# Altium project conn_board.PrjPcb (part 2 of 3)
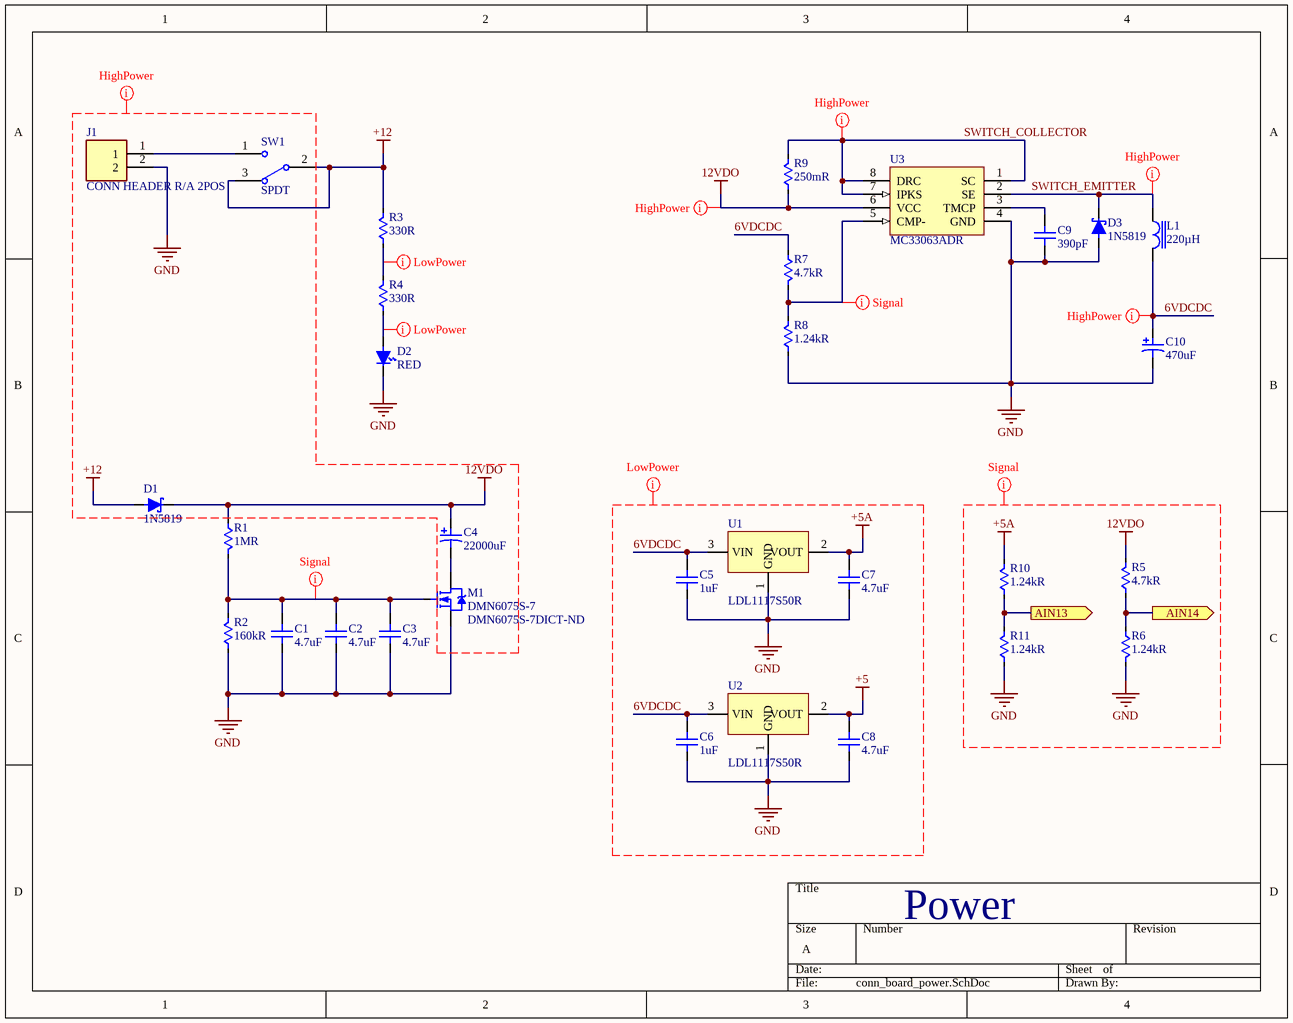
[diagram p3: conn_board_power.SchDoc]

## Sheet conn_board_power.SchDoc (continued)
### Library data of the parts
C1-C3 C7 C8 = CL21A475KAQNNNE: SAMSUNG ELECTRO-MECHANICS - CL21A475KAQNNNE - SMD Multilayer Ceramic Capacitor, 4.7 µF, 25 V, 0805 [2012 Metric], ± 10%, X5R, CL Series; Voltage Rating (DC): 25V; Supplier 1: Digi-Key; Manufacturer: Samsung; Manufacturer Part Number: CL21A475KAQNNNE; RoHS: Yes; Category: Ceramic Capacitors; Stock 1: 671990; Pricing 1: 1=0.11000, 10=0.08100, 50=0.04600, 100=0.03820, 500=0.02678, 1000=0.02216 (USD); Mount: Surface Mount; Case/Package: 0805; Case Code (Metric): 2012; Case Code (Imperial): 0805; Min Operating Temperature: -55°C; Max Operating Temperature: 85°C; Dielectric: X5R; Package Quantity: 1; Packaging: Tape and Reel; Capacitance: 4.7uF; Tolerance: 10%; Voltage Rating: 25V; Length: 2mm; Width: 0.049inch; Height: 1.25mm; Thickness: 0.055inch; Depth: 1.25mm; Radiation Hardening: No; Lead Free: Lead Free; ComponentLink1URL: https://datasheet.ciiva.com/25798/cl21a475kaqnnne-25798882.pdf?src-supplier=Digi-Key; ComponentLink1Description: https://datasheet.ciiva.com/25798/cl21a475kaqnnne-25798882.pdf?src-supplier=Digi-Key; Supplier Part Number 1: 1276-1244-1-ND
C4 = UVR1C223MRD6: Cap Aluminum 22000uF 16V 20% (25 X 40mm) Radial 12.5mm 4000mA 2000 hr 85°C Bulk; Manufacturer: Nichicon; Dielectric Material: Aluminium; Capacitance: 22mF; Ripple Current: 4A; Dissipation Factor: 0.2%; Leakage Current: 10.56mA; Life (Hours): 2000Hour; Lead Diameter: 1mm; Supplier 1: Digi-Key; Manufacturer Part Number: UVR1C223MRD6; Category: Capacitor; Stock 1: 153; Pricing 1: 1=3.85000, 10=3.46700, 50=3.00440, 100=2.61910, 500=2.15694, 1000=2.00287, 2500=1.96436, 5000=1.92584 (USD); Mount: Through Hole; Case/Package: Radial; Number of Pins: 2; Contact Plating: Tin; Min Operating Temperature: -40°C; Max Operating Temperature: 85°C; Package Quantity: 180; Packaging: Bulk; Tolerance: 20%; Voltage Rating: 16V; Termination: Radial; Voltage Rating (DC): 16V; Diameter: 25mm; Length: 40mm; Height: 40mm; Lead Pitch: 12.5mm; Height - Seated (Max): 1.575inch; Radiation Hardening: No; Lead Free: Lead Free; ComponentLink1URL: https://datasheet.ciiva.com/17515/e-vr-17515877.pdf?src-supplier=Avnet+Europe; ComponentLink1Description: https://datasheet.ciiva.com/17515/e-vr-17515877.pdf?src-supplier=Avnet+Europe; ComponentLink2URL: https://datasheet.ciiva.com/118/e-vr-118733.pdf?src-supplier=Digi-Key; ComponentLink2Description: https://datasheet.ciiva.com/118/e-vr-118733.pdf?src-supplier=Digi-Key; ComponentLink3URL: http://datasheet.octopart.com/UVR1C223MRD6-Nichicon-datasheet-2149.pdf?src-supplier=Digi-Key; ComponentLink3Description: http://datasheet.octopart.com/UVR1C223MRD6-Nichicon-datasheet-2149.pdf?src-supplier=Digi-Key; ComponentLink4URL: http://datasheet.octopart.com/UVR1C223MRD6-Nichicon-datasheet-12518647.pdf?src-supplier=Newark; ComponentLink4Description: http://datasheet.octopart.com/UVR1C223MRD6-Nichicon-datasheet-12518647.pdf?src-supplier=Newark; ComponentLink5URL: http://datasheet.octopart.com/UVR1C223MRD6-Nichicon-datasheet-24896455.pdf?src-supplier=TME; ComponentLink5Description: http://datasheet.octopart.com/UVR1C223MRD6-Nichicon-datasheet-24896455.pdf?src-supplier=TME; ComponentLink6URL: http://datasheet.octopart.com/UVR1C223MRD6-Nichicon-datasheet-41169141.pdf?src-supplier=Newark; ComponentLink6Description: http://datasheet.octopart.com/UVR1C223MRD6-Nichicon-datasheet-41169141.pdf?src-supplier=Newark; ComponentLink7URL: http://datasheet.octopart.com/UVR1C223MRD6-Nichicon-datasheet-58177256.pdf?src-supplier=Newark; ComponentLink7Description: http://datasheet.octopart.com/UVR1C223MRD6-Nichicon-datasheet-58177256.pdf?src-supplier=Newark; Supplier Part Number 1: 493-1054-ND
C5 C6 = C0805C105Z4VACTU: Cap Ceramic 1uF 16V Y5V -20% to 80% Pad SMD 0805 85C T/R; Manufacturer: KEMET; Dissipation Factor: 7%; Supplier 1: Digi-Key; Manufacturer Part Number: C0805C105Z4VACTU; Category: Capacitor; Stock 1: 83211; Pricing 1: 1=0.11000, 10=0.08100, 50=0.04420, 100=0.03620, 500=0.02584, 1000=0.02030 (USD); Mount: Surface Mount; Case/Package: 0805; Number of Pins: 2; Case Code (Metric): 2012; Case Code (Imperial): 0805; Contact Material: Tin; Dielectric Material: Ceramic; Min Operating Temperature: -30°C; Max Operating Temperature: 85°C; Package Quantity: 1; Capacitance: 1uF; Voltage Rating: 16V; Tolerance: 80%; Packaging: Tape and Reel; Voltage Rating (DC): 16V; Dielectric: Y5V; Termination: SMD/SMT; Voltage: 16V; Length: 2mm; Height: 1.25mm; Width: 0.049inch; Thickness: 0.055inch; Lead Pitch: 0.75mm; Depth: 1.25mm; Radiation Hardening: No; REACH SVHC: No SVHC; Lead Free: Lead Free; ComponentLink1URL: https://datasheet.ciiva.com/6074/1698780-6074369.pdf?src-supplier=Farnell; ComponentLink1Description: https://datasheet.ciiva.com/6074/1698780-6074369.pdf?src-supplier=Farnell; ComponentLink2URL: https://datasheet.ciiva.com/16623/datasheetpn-c0805c105z4vac7800-16623623.pdf?src-supplier=Avnet+Europe; ComponentLink2Description: https://datasheet.ciiva.com/16623/datasheetpn-c0805c105z4vac7800-16623623.pdf?src-supplier=Avnet+Europe; ComponentLink3URL: https://datasheet.ciiva.com/14604/70095383-14604106.pdf?src-supplier=Allied+Electronics; ComponentLink3Description: https://datasheet.ciiva.com/14604/70095383-14604106.pdf?src-supplier=Allied+Electronics; ComponentLink4URL: https://datasheet.ciiva.com/7600/1698780-7600029.pdf?src-supplier=Newark; ComponentLink4Description: https://datasheet.ciiva.com/7600/1698780-7600029.pdf?src-supplier=Newark; ComponentLink5URL: https://datasheet.ciiva.com/14589/70095383-14589407.pdf?src-supplier=Allied+Electronics; ComponentLink5Description: https://datasheet.ciiva.com/14589/70095383-14589407.pdf?src-supplier=Allied+Electronics; ComponentLink6URL: http://datasheet.octopart.com/C0805C105Z4VACTU-Kemet-datasheet-13692877.pdf?src-supplier=Element14; ComponentLink6Description: http://datasheet.octopart.com/C0805C105Z4VACTU-Kemet-datasheet-13692877.pdf?src-supplier=Element14; ComponentLink7URL: http://datasheet.octopart.com/C0805C105Z4VACTU-Kemet-datasheet-503297.pdf?src-supplier=Newark; ComponentLink7Description: http://datasheet.octopart.com/C0805C105Z4VACTU-Kemet-datasheet-503297.pdf?src-supplier=Newark; ComponentLink8URL: http://datasheet.octopart.com/C0805C105Z4VACTU-KEMET-datasheet-101576167.pdf?src-supplier=Farnell; ComponentLink8Description: http://datasheet.octopart.com/C0805C105Z4VACTU-KEMET-datasheet-101576167.pdf?src-supplier=Farnell; ComponentLink9URL: http://datasheet.octopart.com/C0805C105Z4VACTU-KEMET-datasheet-83957834.pdf?src-supplier=TME; ComponentLink9Description: http://datasheet.octopart.com/C0805C105Z4VACTU-KEMET-datasheet-83957834.pdf?src-supplier=TME; ComponentLink10URL: http://datasheet.octopart.com/C0805C105Z4VACTU-Kemet-datasheet-5313890.pdf?src-supplier=Verical; ComponentLink10Description: http://datasheet.octopart.com/C0805C105Z4VACTU-Kemet-datasheet-5313890.pdf?src-supplier=Verical; ComponentLink11URL: http://datasheet.octopart.com/C0805C105Z4VAC-TU-Kemet-datasheet-8204015.pdf?src-supplier=Jameco; ComponentLink11Description: http://datasheet.octopart.com/C0805C105Z4VAC-TU-Kemet-datasheet-8204015.pdf?src-supplier=Jameco; ComponentLink12URL: http://datasheet.octopart.com/C0805C105Z4VACTU-Kemet-datasheet-464.pdf?src-supplier=Allied+Electronics; ComponentLink12Description: http://datasheet.octopart.com/C0805C105Z4VACTU-Kemet-datasheet-464.pdf?src-supplier=Allied+Electronics; ComponentLink13URL: http://datasheet.octopart.com/C0805C105Z4VACTU-Kemet-datasheet-11554470.pdf?src-supplier=Arrow; ComponentLink13Description: http://datasheet.octopart.com/C0805C105Z4VACTU-Kemet-datasheet-11554470.pdf?src-supplier=Arrow; ComponentLink14URL: http://datasheet.octopart.com/C0805C105Z4VACTU-Kemet-datasheet-66128697.pdf?src-supplier=Element14; ComponentLink14Description: http://datasheet.octopart.com/C0805C105Z4VACTU-Kemet-datasheet-66128697.pdf?src-supplier=Element14; ComponentLink15URL: http://datasheet.octopart.com/C0805C105Z4VACTU-Kemet-datasheet-66325528.pdf?src-supplier=Newark; ComponentLink15Description: http://datasheet.octopart.com/C0805C105Z4VACTU-Kemet-datasheet-66325528.pdf?src-supplier=Newark; ComponentLink16URL: http://datasheet.octopart.com/C0805C105Z4VACTU-Kemet-datasheet-67847115.pdf?src-supplier=TME; ComponentLink16Description: http://datasheet.octopart.com/C0805C105Z4VACTU-Kemet-datasheet-67847115.pdf?src-supplier=TME; ComponentLink17URL: http://datasheet.octopart.com/C0805C105Z4VACTU-KEMET-datasheet-84169754.pdf; ComponentLink17Description: http://datasheet.octopart.com/C0805C105Z4VACTU-KEMET-datasheet-84169754.pdf; ComponentLink18URL: http://datasheet.octopart.com/C0805C105Z4VACTU-KEMET-datasheet-41193421.pdf?src-supplier=Master+Electronics; ComponentLink18Description: http://datasheet.octopart.com/C0805C105Z4VACTU-KEMET-datasheet-41193421.pdf?src-supplier=Master+Electronics; Supplier Part Number 1: 399-8011-1-ND
C9 = CL21C391JBANNNC: Cap Ceramic 390pF 50V C0G 5% SMD 0805 125C Paper T/R; Manufacturer: Samsung; Temperature Coefficient: 300ppm/°C; Supplier 1: Digi-Key; Manufacturer Part Number: CL21C391JBANNNC; RoHS: Yes; Category: Ceramic Capacitors; Stock 1: 98292; Pricing 1: 1=0.11000, 10=0.08400, 50=0.04580, 100=0.03740, 500=0.02668, 1000=0.02096 (USD); Mount: Surface Mount; Case/Package: 0805; Case Code (Metric): 2012; Case Code (Imperial): 0805; Material: Ceramic; Min Operating Temperature: -55°C; Max Operating Temperature: 125°C; Tolerance: 5%; Capacitance: 390pF; Dielectric: C0G; Package Quantity: 1; Packaging: Tape and Reel; Voltage Rating: 50V; Voltage: 50V; Series: CL; Construction: Flat; Length: 2mm; Width: 0.049inch; Height: 0.65mm; Depth: 1.25mm; Thickness: 0.03inch; Radiation Hardening: No; RoHS Compliant: Yes; ComponentLink1URL: https://datasheet.ciiva.com/25733/cl21c391jbannnc-25733106.pdf?src-supplier=Digi-Key; ComponentLink1Description: https://datasheet.ciiva.com/25733/cl21c391jbannnc-25733106.pdf?src-supplier=Digi-Key; ComponentLink2URL: https://datasheet.ciiva.com/26838/getdatasheetpartid-687114-26838793.pdf?src-supplier=Verical; ComponentLink2Description: https://datasheet.ciiva.com/26838/getdatasheetpartid-687114-26838793.pdf?src-supplier=Verical; ComponentLink3URL: https://datasheet.ciiva.com/29200/453712-da-01-en-vs-kondensator-0805-29200047.pdf?src-supplier=Conrad; ComponentLink3Description: https://datasheet.ciiva.com/29200/453712-da-01-en-vs-kondensator-0805-29200047.pdf?src-supplier=Conrad; ComponentLink4URL: https://datasheet.ciiva.com/16448/cl05b104kq5nnnc-16448985.pdf?src-supplier=Future+Electronics; ComponentLink4Description: https://datasheet.ciiva.com/16448/cl05b104kq5nnnc-16448985.pdf?src-supplier=Future+Electronics; Supplier Part Number 1: 1276-1303-1-ND
C10 = UUD1C471MNL1GS: NICHICON   UUD1C471MNL1GS   CAP, ALU ELEC, 470UF, 16V, SMD; Dielectric Material: Aluminium; Tolerance: 20%; Leakage Current: 3uA; Ripple Current: 450mA; Life (Hours): 5000Hour; Dissipation Factor: 0.2%; Impedance: 170mR; Lead Diameter: 1.1mm; Supplier 1: Digi-Key; Manufacturer: Nichicon; Manufacturer Part Number: UUD1C471MNL1GS; RoHS: Yes; Category: Capacitor; Stock 1: 11602; Pricing 1: 1=0.69000, 10=0.50800, 25=0.43560, 100=0.34850, 250=0.31948 (USD); Case/Package: Radial; Number of Pins: 2; Contact Plating: Tin; Min Operating Temperature: -55°C; Max Operating Temperature: 105°C; Voltage Rating (DC): 16V; Capacitance: 470uF; Packaging: Tape and Reel; Package Quantity: 500; Voltage Rating: 16V; Termination: SMD/SMT; Voltage: 16V; Ripple Current (AC): 450mA; Diameter: 8mm; Length: 10mm; Height: 10mm; Height - Seated (Max): 0.394inch; Lead Pitch: 3.1mm; Radiation Hardening: No; REACH SVHC: No SVHC; Lead Free: Lead Free; ComponentLink1URL: https://datasheet.ciiva.com/11781/0900766b80fa39e7-11781894.pdf?src-supplier=RSComponents; ComponentLink1Description: https://datasheet.ciiva.com/11781/0900766b80fa39e7-11781894.pdf?src-supplier=RSComponents; ComponentLink2URL: https://datasheet.ciiva.com/97/e-ud-97896.pdf?src-supplier=Digi-Key; ComponentLink2Description: https://datasheet.ciiva.com/97/e-ud-97896.pdf?src-supplier=Digi-Key; ComponentLink3URL: https://datasheet.ciiva.com/7781/66055-7781448.pdf?src-supplier=Element14; ComponentLink3Description: https://datasheet.ciiva.com/7781/66055-7781448.pdf?src-supplier=Element14; ComponentLink4URL: https://datasheet.ciiva.com/97/e-ud-97897.pdf?src-supplier=Digi-Key; ComponentLink4Description: https://datasheet.ciiva.com/97/e-ud-97897.pdf?src-supplier=Digi-Key; ComponentLink5URL: https://datasheet.ciiva.com/22693/66055-22693551.pdf?src-supplier=Element14; ComponentLink5Description: https://datasheet.ciiva.com/22693/66055-22693551.pdf?src-supplier=Element14; ComponentLink6URL: https://datasheet.ciiva.com/97/e-ud-97898.pdf?src-supplier=Digi-Key; ComponentLink6Description: https://datasheet.ciiva.com/97/e-ud-97898.pdf?src-supplier=Digi-Key; ComponentLink7URL: https://datasheet.ciiva.com/11685/e-ud-11685293.pdf?src-supplier=Avnet; ComponentLink7Description: https://datasheet.ciiva.com/11685/e-ud-11685293.pdf?src-supplier=Avnet; ComponentLink8URL: https://datasheet.ciiva.com/16502/e-ud-16502751.pdf?src-supplier=Future+Electronics; ComponentLink8Description: https://datasheet.ciiva.com/16502/e-ud-16502751.pdf?src-supplier=Future+Electronics; Supplier Part Number 1: 493-2266-1-ND
D1 D3 = 1N5819HW-7-F: DIODES INC. - 1N5819HW-7-F - DIODE, SCKY RECTI, 1A, 40V, SOD123; Element Configuration: Single; Peak Non-Repetitive Surge Current: 25A; Forward Voltage: 450mV; Peak Reverse Current: 50uA; Polarity: Standard; Capacitance: 110pF; Max Power Dissipation: 450mW; Supplier 1: Digi-Key; Manufacturer: Diodes; Manufacturer Part Number: 1N5819HW-7-F; RoHS: Yes; Category: Diode; Stock 1: 502732; Pricing 1: 1=0.40000, 10=0.30100, 25=0.26360, 100=0.14310, 500=0.11678, 1000=0.08664 (USD); Case/Package: SOD-123-2; Number of Pins: 2; Weight: 0.000353oz; Contact Plating: Tin,Matte; Min Operating Temperature: -65°C; Max Operating Temperature: 125°C; Packaging: Tape and Reel; Package Quantity: 3000; Forward Current: 1A; Max Repetitive Reverse Voltage (Vrrm): 40V; Average Rectified Current: 1A; Max Reverse Voltage (DC): 40V; Max Forward Surge Current (Ifsm): 25A; Current Rating: 1A; Voltage Rating (DC): 40V; Output Current: 1A; Termination: SMD/SMT; Length: 2.85mm; Height: 1.25mm; Width: 1.7mm; Radiation Hardening: No; Lead Free: Lead Free; REACH SVHC: No SVHC; ComponentLink1URL: https://datasheet.ciiva.com/16303/ds30217-16303296.pdf?src-supplier=Future+Electronics; ComponentLink1Description: https://datasheet.ciiva.com/16303/ds30217-16303296.pdf?src-supplier=Future+Electronics; ComponentLink2URL: https://datasheet.ciiva.com/27092/1538419-27092484.pdf?src-supplier=Jameco; ComponentLink2Description: https://datasheet.ciiva.com/27092/1538419-27092484.pdf?src-supplier=Jameco; ComponentLink3URL: https://datasheet.ciiva.com/912/ds30217-912801.pdf?src-supplier=Digi-Key; ComponentLink3Description: https://datasheet.ciiva.com/912/ds30217-912801.pdf?src-supplier=Digi-Key; ComponentLink4URL: https://datasheet.ciiva.com/1177/ds30217-1177089.pdf?src-supplier=Element14; ComponentLink4Description: https://datasheet.ciiva.com/1177/ds30217-1177089.pdf?src-supplier=Element14; ComponentLink5URL: https://datasheet.ciiva.com/912/ds30217-912802.pdf?src-supplier=Digi-Key; ComponentLink5Description: https://datasheet.ciiva.com/912/ds30217-912802.pdf?src-supplier=Digi-Key; ComponentLink6URL: https://datasheet.ciiva.com/912/ds30217-912803.pdf?src-supplier=Digi-Key; ComponentLink6Description: https://datasheet.ciiva.com/912/ds30217-912803.pdf?src-supplier=Digi-Key; ComponentLink7URL: https://datasheet.ciiva.com/8303/ds30217-8303132.pdf?src-supplier=Avnet; ComponentLink7Description: https://datasheet.ciiva.com/8303/ds30217-8303132.pdf?src-supplier=Avnet; ComponentLink8URL: https://datasheet.ciiva.com/25919/ds30217-25919644.pdf?src-supplier=Avnet+Europe; ComponentLink8Description: https://datasheet.ciiva.com/25919/ds30217-25919644.pdf?src-supplier=Avnet+Europe; Supplier Part Number 1: 1N5819HW-FDICT-ND
D2 = 150080SS75000: WURTH ELEKTRONIK   150080SS75000   LED, 0805, SUP RED, 60MCD, 630NM; Manufacturer: Wurth Electronics; Forward Current: 30mA; Forward Voltage: 1.9V; Viewing Angle: 140°; Lens Style: Clear,Rectangular; Test Current: 20mA; Supplier 1: Digi-Key; Manufacturer Part Number: 150080SS75000; RoHS: Yes; Category: LEDs; Stock 1: 6006; Pricing 1: 1=0.18000, 50=0.16500, 100=0.14200, 500=0.12300 (USD); Mount: Surface Mount; Case/Package: 0805; Color: Red; Case Code (Metric): 2012; Case Code (Imperial): 0805; Min Operating Temperature: -40°C; Max Operating Temperature: 85°C; Luminous Intensity: 60mcd; Wavelength: 630nm; Package Quantity: 4000; Packaging: Tape and Reel; Dominant Wavelength: 630nm; Length: 2mm; Height: 0.7mm; Width: 1.25mm; REACH SVHC: Unknown; ComponentLink1URL: https://datasheet.ciiva.com/22656/150080ss75000-22656963.pdf?src-supplier=Element14; ComponentLink1Description: https://datasheet.ciiva.com/22656/150080ss75000-22656963.pdf?src-supplier=Element14; ComponentLink2URL: https://datasheet.ciiva.com/29279/759436-da-01-en-chipled-0805-w-kl-s-rot-150080ss75000-29279211.pdf?src-supplier=Conrad; ComponentLink2Description: https://datasheet.ciiva.com/29279/759436-da-01-en-chipled-0805-w-kl-s-rot-150080ss75000-29279211.pdf?src-supplier=Conrad; ComponentLink3URL: https://datasheet.ciiva.com/29563/150080ss75000-29563014.pdf?src-supplier=Digi-Key; ComponentLink3Description: https://datasheet.ciiva.com/29563/150080ss75000-29563014.pdf?src-supplier=Digi-Key; ComponentLink4URL: https://datasheet.ciiva.com/29563/150080ss75000-29563015.pdf?src-supplier=Digi-Key; ComponentLink4Description: https://datasheet.ciiva.com/29563/150080ss75000-29563015.pdf?src-supplier=Digi-Key; ComponentLink5URL: https://datasheet.ciiva.com/29563/150080ss75000-29563013.pdf?src-supplier=Digi-Key; ComponentLink5Description: https://datasheet.ciiva.com/29563/150080ss75000-29563013.pdf?src-supplier=Digi-Key; Supplier Part Number 1: 732-4985-1-ND
J1 = 1724480002: Manufacturer: Molex; Connector Type: Male Pin; Number of Circuits: 2; Row Spacing: 0.165inch; Glow Wire Compliant: Compliant; Supplier 1: Digi-Key; Manufacturer Part Number: 1724480002; RoHS: No; Category: Headers and Wire Housings; Stock 1: 6210; Pricing 1: 1=0.55000, 10=0.46000, 100=0.35780, 1000=0.28116, 5000=0.24708, 10000=0.23004 (USD); Mount: Through Hole; Number of Pins: 2; Contact Plating: Tin; Color: Black; Orientation: Right Angle; Packaging: Tray; Number of Positions: 2; Number of Rows: 2; Termination: Solder; Fastening Type: Ramp; ComponentLink1URL: https://www.molex.com/pdm_docs/sd/1724480002_sd.pdf?src-supplier=Digi-Key; ComponentLink1Description: https://www.molex.com/pdm_docs/sd/1724480002_sd.pdf?src-supplier=Digi-Key; Supplier Part Number 1: WM16206-ND
L1 = SRR1260-221K: BOURNS   SRR1260-221K   INDUCTOR, SHIELDED, 220UH, 1.3A, SMD; MF: Bourns - J.W. Miller; Core Material: Ferrite; Material: Steel; Tolerance: 10%; Max DC Current: 1.38A; DC Resistance (DCR): 380mR; Test Frequency: 100kHz; Self Resonant Frequency: 4.2MHz; Q Factor: 22; Value: *; Package: Nonstandard Bourns - J.W. Miller; Availability: Unavailable; SnapEDA_Link: https://www.snapeda.com/parts/SRR1260-221K/Bourns%20-%20J.W.%20Miller/view-part/50181/?ref=snap; MP: SRR1260-221K; Price: None; Category: Inductor; Supplier 1: Digi-Key; Manufacturer: Bourns; Manufacturer Part Number: SRR1260-221K; RoHS: Yes; Stock 1: 17151; Pricing 1: 1=1.09000, 10=1.00800, 25=0.93000, 50=0.77500, 100=0.72850, 250=0.65100 (USD); Mount: Surface Mount; Case/Package: 1260; Number of Pins: 2; Min Operating Temperature: -40°C; Max Operating Temperature: 125°C; Packaging: Tape and Reel; Termination: SMD/SMT; Resistor Type: Wirewound; Package Quantity: 600; Inductance: 220uH; Resistance: 380MR; DC Current: 1.38A; Shielding: Shielded; Current Rating: 1.38A; Saturation Current: 1.3A; RMS Current (Irms): 1.38A; Inductance Tolerance: 10%; Frequency: 4.2MHz; Length: 12.5mm; Width: 12.5mm; Height: 6mm; Depth: 12.8mm; Height - Seated (Max): 0.256inch; Military Standard: Not; REACH SVHC: No SVHC; ComponentLink1URL: https://datasheet.ciiva.com/11800/0900766b80defded-11800204.pdf?src-supplier=RSComponents; ComponentLink1Description: https://datasheet.ciiva.com/11800/0900766b80defded-11800204.pdf?src-supplier=RSComponents; ComponentLink2URL: https://datasheet.ciiva.com/7838/1430852-7838981.pdf?src-supplier=Element14; ComponentLink2Description: https://datasheet.ciiva.com/7838/1430852-7838981.pdf?src-supplier=Element14; ComponentLink3URL: https://datasheet.ciiva.com/1050/srr1260-1050007.pdf?src-supplier=Digi-Key; ComponentLink3Description: https://datasheet.ciiva.com/1050/srr1260-1050007.pdf?src-supplier=Digi-Key; ComponentLink4URL: https://datasheet.ciiva.com/17111/70277056-17111848.pdf?src-supplier=Allied+Electronics; ComponentLink4Description: https://datasheet.ciiva.com/17111/70277056-17111848.pdf?src-supplier=Allied+Electronics; ComponentLink5URL: https://datasheet.ciiva.com/23793/1914016-23793576.pdf?src-supplier=Newark; ComponentLink5Description: https://datasheet.ciiva.com/23793/1914016-23793576.pdf?src-supplier=Newark; ComponentLink6URL: https://datasheet.ciiva.com/17285/srr1260-17285833.pdf?src-supplier=Avnet+Europe; ComponentLink6Description: https://datasheet.ciiva.com/17285/srr1260-17285833.pdf?src-supplier=Avnet+Europe; ComponentLink7URL: https://datasheet.ciiva.com/8517/srr1260-8517134.pdf?src-supplier=Avnet; ComponentLink7Description: https://datasheet.ciiva.com/8517/srr1260-8517134.pdf?src-supplier=Avnet; ComponentLink8URL: https://datasheet.ciiva.com/22618/70796-22618159.pdf?src-supplier=Element14; ComponentLink8Description: https://datasheet.ciiva.com/22618/70796-22618159.pdf?src-supplier=Element14; ComponentLink9URL: https://datasheet.ciiva.com/28679/1430852-28679711.pdf?src-supplier=Element14; ComponentLink9Description: https://datasheet.ciiva.com/28679/1430852-28679711.pdf?src-supplier=Element14; ComponentLink10URL: https://datasheet.ciiva.com/1050/srr1260-1050006.pdf?src-supplier=Digi-Key; ComponentLink10Description: https://datasheet.ciiva.com/1050/srr1260-1050006.pdf?src-supplier=Digi-Key; ComponentLink11URL: https://datasheet.ciiva.com/1050/srr1260-1050008.pdf?src-supplier=Digi-Key; ComponentLink11Description: https://datasheet.ciiva.com/1050/srr1260-1050008.pdf?src-supplier=Digi-Key; Supplier Part Number 1: SRR1260-221KCT-ND
M1 = CMP-12801-000014-1: MOSFET 60V N-Ch Enh FET 20Vgss 0.8W 600pF; Manufacturer: Diodes Inc.; Max Junction Temp: +150°C; Continuous Drain Current: 2A; Rthja Max: 157°C/W; Turn On Delay Time: 3.5ns; Gate To Source Voltage: 20V; Input Capacitace At Vds: 606pF @ 20V; Depletion Mode: False; Number Of Channels: 1; Pulse Drain Current: 12A; Standoff Height: 0.013mm; Turn Off Delay Time: 35ns; Threshold Vgs Max: 3V; Automotive Grade: Grade 0; Max Forward Diode Voltage: 1.2V; Gate Charge At Vgs: 12.3nC @ 10V; Threshold Vgs Min: 1V; Drain To Source Resistance: 69mΩ; Rds On Max: 85mR; Input Capacitance: 606pF; Max Power Dissipation: 800mW; Device Class L2: Transistors; Height: 1.1mm; ComponentLink2Description: Datasheet; Footprint Url: https://www.diodes.com/assets/Package-Files/SOT23.pdf; Device Class L1: Discrete Semiconductors; Digikey Description: MOSFET N-CH 60V 2A SOT23-3; Device Class L3: MOSFETs; Mouser Description: MOSFET 60V N-Ch Enh FET 20Vgss 0.8W 600pF; Manufacturer Part Number: DMN6075S-7; Package: SOT23; Power Dissipation: 0.8W; Temperature Range High: +150°C; Drain To Source Breakdown Voltage: 60V; Automotive: Yes; Lead Free: Yes; ComponentLink2URL: https://www.diodes.com/assets/Datasheets/DMN6075S.pdf; Category: Trans; Temperature Range Low: -55°C; Number Of N Channels: 1; Octopart: https://octopart.com/dmn6075s-7-diodes+inc.-55697882; RoHS: TRUE; Temperature: -55°C to +150°C; Drain To Source Voltage: 60V; Supplier 1: Digi-Key; Stock 1: 363651; Pricing 1: 1=0.33000, 10=0.23000, 25=0.21440, 100=0.11630, 500=0.09486, 1000=0.07038 (USD); Mount: Surface Mount; Case/Package: TO-236-3; Min Operating Temperature: -55°C; Max Operating Temperature: 150°C; Packaging: Tape and Reel; Drain to Source Voltage (Vdss): 60V; Continuous Drain Current (ID): 2A; ComponentLink1URL: http://www.mouser.com/ds/2/115/DMN6075S-532804.pdf?src-supplier=Mouser; ComponentLink1Description: http://www.mouser.com/ds/2/115/DMN6075S-532804.pdf?src-supplier=Mouser; ComponentLink3URL: https://www.diodes.com/assets/Datasheets/DMN6075S.pdf?src-supplier=Digi-Key; ComponentLink3Description: https://www.diodes.com/assets/Datasheets/DMN6075S.pdf?src-supplier=Digi-Key
R1 = ERJ-6ENF1004V: Res Thick Film 0805 1M Ohm 1% 1/8W ±100ppm/°C Molded SMD Punched Carrier T/R; Manufacturer: Panasonic; Power Rating: 125mW; Voltage Rating: 150V; Supplier 1: Digi-Key; Manufacturer Part Number: ERJ-6ENF1004V; Category: Resistor; Stock 1: 249385; Pricing 1: 1=0.10000, 10=0.06900, 100=0.02650, 1000=0.01166, 2500=0.01007 (USD); Mount: Surface Mount; Case/Package: 0805; Number of Pins: 2; Case Code (Imperial): 0805; Case Code (Metric): 2012; Contact Plating: Tin; Min Operating Temperature: -55°C; Max Operating Temperature: 155°C; Package Quantity: 1; Resistance: 1MR; Packaging: Tape and Reel; Tolerance: 1%; Termination: SMD/SMT; Composition: Thick Film; Number of Terminations: 2; Military Standard: Not; Temperature Coefficient: 100ppm/°C; Max Power Dissipation: 125mW; Voltage Rating (DC): 150V; Features: Automotive AEC-Q200; Length: 2mm; Height: 0.6mm; Width: 1.2mm; Depth: 1.25mm; Radiation Hardening: No; REACH SVHC: No SVHC; Lead Free: Lead Free; ComponentLink1URL: https://datasheet.ciiva.com/11821/0900766b80f80784-11821573.pdf?src-supplier=RSComponents; ComponentLink1Description: https://datasheet.ciiva.com/11821/0900766b80f80784-11821573.pdf?src-supplier=RSComponents; ComponentLink2URL: https://datasheet.ciiva.com/16761/70260748-16761141.pdf?src-supplier=Allied+Electronics; ComponentLink2Description: https://datasheet.ciiva.com/16761/70260748-16761141.pdf?src-supplier=Allied+Electronics; ComponentLink3URL: https://datasheet.ciiva.com/22749/426256-22749637.pdf?src-supplier=Element14; ComponentLink3Description: https://datasheet.ciiva.com/22749/426256-22749637.pdf?src-supplier=Element14; ComponentLink4URL: https://datasheet.ciiva.com/30161/aoa0000ce2-30161525.pdf?src-supplier=Onlinecomponents.com; ComponentLink4Description: https://datasheet.ciiva.com/30161/aoa0000ce2-30161525.pdf?src-supplier=Onlinecomponents.com; ComponentLink5URL: https://datasheet.ciiva.com/48532/aoa0000ce2-48532149.pdf?src-supplier=Avnet; ComponentLink5Description: https://datasheet.ciiva.com/48532/aoa0000ce2-48532149.pdf?src-supplier=Avnet; ComponentLink6URL: https://datasheet.ciiva.com/8079/426256-8079622.pdf?src-supplier=Element14; ComponentLink6Description: https://datasheet.ciiva.com/8079/426256-8079622.pdf?src-supplier=Element14; ComponentLink7URL: https://datasheet.ciiva.com/27055/1988997-27055735.pdf?src-supplier=Jameco; ComponentLink7Description: https://datasheet.ciiva.com/27055/1988997-27055735.pdf?src-supplier=Jameco; ComponentLink8URL: https://datasheet.ciiva.com/5868/426256-5868184.pdf?src-supplier=Farnell; ComponentLink8Description: https://datasheet.ciiva.com/5868/426256-5868184.pdf?src-supplier=Farnell; ComponentLink9URL: https://datasheet.ciiva.com/46420/1678782-46420186.pdf?src-supplier=Element14; ComponentLink9Description: https://datasheet.ciiva.com/46420/1678782-46420186.pdf?src-supplier=Element14; ComponentLink10URL: https://datasheet.ciiva.com/16788/70260748-16788299.pdf?src-supplier=Allied+Electronics; ComponentLink10Description: https://datasheet.ciiva.com/16788/70260748-16788299.pdf?src-supplier=Allied+Electronics; ComponentLink11URL: https://datasheet.ciiva.com/7909/426256-7909229.pdf?src-supplier=Element14; ComponentLink11Description: https://datasheet.ciiva.com/7909/426256-7909229.pdf?src-supplier=Element14; ComponentLink12URL: https://datasheet.ciiva.com/15158/getdatasheetpartid-246555-15158845.pdf?src-supplier=Verical; ComponentLink12Description: https://datasheet.ciiva.com/15158/getdatasheetpartid-246555-15158845.pdf?src-supplier=Verical; ComponentLink13URL: http://datasheet.octopart.com/ERJ-6ENF1004V-Panasonic-datasheet-5313456.pdf?src-supplier=Farnell; ComponentLink13Description: http://datasheet.octopart.com/ERJ-6ENF1004V-Panasonic-datasheet-5313456.pdf?src-supplier=Farnell; ComponentLink14URL: http://datasheet.octopart.com/ERJ-6ENF1004V-Panasonic-datasheet-13266541.pdf?src-supplier=Allied+Electronics; ComponentLink14Description: http://datasheet.octopart.com/ERJ-6ENF1004V-Panasonic-datasheet-13266541.pdf?src-supplier=Allied+Electronics; ComponentLink15URL: http://datasheet.octopart.com/ERJ-6ENF1004V-Panasonic-datasheet-48891056.pdf?src-supplier=Newark; ComponentLink15Description: http://datasheet.octopart.com/ERJ-6ENF1004V-Panasonic-datasheet-48891056.pdf?src-supplier=Newark; ComponentLink16URL: http://datasheet.octopart.com/ERJ-6ENF1004V-Panasonic-datasheet-8853621.pdf?src-supplier=Future+Electronics; ComponentLink16Description: http://datasheet.octopart.com/ERJ-6ENF1004V-Panasonic-datasheet-8853621.pdf?src-supplier=Future+Electronics; ComponentLink17URL: http://datasheet.octopart.com/ERJ-6ENF1004V-Panasonic-datasheet-10025800.pdf?src-supplier=Future+Electronics; ComponentLink17Description: http://datasheet.octopart.com/ERJ-6ENF1004V-Panasonic-datasheet-10025800.pdf?src-supplier=Future+Electronics; ComponentLink18URL: http://datasheet.octopart.com/ERJ-6ENF1004V-Panasonic-datasheet-136608610.pdf?src-supplier=Farnell; ComponentLink18Description: http://datasheet.octopart.com/ERJ-6ENF1004V-Panasonic-datasheet-136608610.pdf?src-supplier=Farnell; ComponentLink19URL: http://datasheet.octopart.com/ERJ-6ENF1004V-Panasonic-datasheet-41391857.pdf?src-supplier=Electro+Sonic; ComponentLink19Description: http://datasheet.octopart.com/ERJ-6ENF1004V-Panasonic-datasheet-41391857.pdf?src-supplier=Electro+Sonic; ComponentLink20URL: http://datasheet.octopart.com/ERJ-6ENF1004V-Panasonic-datasheet-7538305.pdf?src-supplier=Jameco; ComponentLink20Description: http://datasheet.octopart.com/ERJ-6ENF1004V-Panasonic-datasheet-7538305.pdf?src-supplier=Jameco; ComponentLink21URL: http://datasheet.octopart.com/ERJ-6ENF1004V-Panasonic-datasheet-78375410.pdf; ComponentLink21Description: http://datasheet.octopart.com/ERJ-6ENF1004V-Panasonic-datasheet-78375410.pdf; ComponentLink22URL: http://datasheet.octopart.com/ERJ-6ENF1004V-Panasonic-datasheet-82288794.pdf?src-supplier=Future+Electronics; ComponentLink22Description: http://datasheet.octopart.com/ERJ-6ENF1004V-Panasonic-datasheet-82288794.pdf?src-supplier=Future+Electronics; ComponentLink23URL: http://datasheet.octopart.com/ERJ-6ENF1004V-Panasonic-datasheet-118602.pdf?src-supplier=Digi-Key; ComponentLink23Description: http://datasheet.octopart.com/ERJ-6ENF1004V-Panasonic-datasheet-118602.pdf?src-supplier=Digi-Key; ComponentLink24URL: http://datasheet.octopart.com/ERJ-6ENF1004V-Panasonic---ECG-datasheet-15994758.pdf?src-supplier=Farnell; ComponentLink24Description: http://datasheet.octopart.com/ERJ-6ENF1004V-Panasonic---ECG-datasheet-15994758.pdf?src-supplier=Farnell; Supplier Part Number 1: P1.00MCCT-ND
R2 = ERJ-6ENF1603V: Res Thick Film 0805 160K Ohm 1% 1/8W ±100ppm/°C Molded SMD Punched Carrier T/R; Manufacturer: Panasonic; Max Power Dissipation: 125mW; Voltage Rating: 150V; Supplier 1: Digi-Key; Manufacturer Part Number: ERJ-6ENF1603V; Category: Resistor; Stock 1: 46420; Pricing 1: 1=0.10000, 10=0.07200, 100=0.02750, 1000=0.01210, 2500=0.01045 (USD); Mount: Surface Mount; Case/Package: 0805; Contact Plating: Tin; Case Code (Metric): 2012; Case Code (Imperial): 0805; Min Operating Temperature: -55°C; Max Operating Temperature: 155°C; Composition: Thick Film; Number of Terminations: 2; Termination: SMD/SMT; Military Standard: Not; Temperature Coefficient: 100ppm/°C; Features: Automotive AEC-Q200; Resistance: 160kR; Power Rating: 125mW; Tolerance: 1%; Packaging: Tape and Reel; Package Quantity: 1; Length: 2mm; Height: 0.028inch; Depth: 1.25mm; Width: 0.049inch; Radiation Hardening: No; REACH SVHC: No SVHC; ComponentLink1URL: https://datasheet.ciiva.com/22674/1678782-22674517.pdf?src-supplier=Element14; ComponentLink1Description: https://datasheet.ciiva.com/22674/1678782-22674517.pdf?src-supplier=Element14; ComponentLink2URL: https://datasheet.ciiva.com/46436/1678782-46436469.pdf?src-supplier=Element14; ComponentLink2Description: https://datasheet.ciiva.com/46436/1678782-46436469.pdf?src-supplier=Element14; ComponentLink3URL: https://datasheet.ciiva.com/46436/1678782-46436470.pdf?src-supplier=Element14; ComponentLink3Description: https://datasheet.ciiva.com/46436/1678782-46436470.pdf?src-supplier=Element14; ComponentLink4URL: https://datasheet.ciiva.com/17207/aoa0000ce2-17207337.pdf?src-supplier=Avnet+Europe; ComponentLink4Description: https://datasheet.ciiva.com/17207/aoa0000ce2-17207337.pdf?src-supplier=Avnet+Europe; ComponentLink5URL: https://datasheet.ciiva.com/9185/aoa0000ce2-9185402.pdf?src-supplier=Avnet; ComponentLink5Description: https://datasheet.ciiva.com/9185/aoa0000ce2-9185402.pdf?src-supplier=Avnet; ComponentLink6URL: https://datasheet.ciiva.com/22739/1678782-22739739.pdf?src-supplier=Element14; ComponentLink6Description: https://datasheet.ciiva.com/22739/1678782-22739739.pdf?src-supplier=Element14; ComponentLink7URL: https://datasheet.ciiva.com/24060/aoa0000ce2-24060654.pdf?src-supplier=Mouser; ComponentLink7Description: https://datasheet.ciiva.com/24060/aoa0000ce2-24060654.pdf?src-supplier=Mouser; ComponentLink8URL: http://datasheet.octopart.com/ERJ-6ENF1603V-Panasonic-datasheet-13266541.pdf?src-supplier=Newark; ComponentLink8Description: http://datasheet.octopart.com/ERJ-6ENF1603V-Panasonic-datasheet-13266541.pdf?src-supplier=Newark; ComponentLink9URL: http://datasheet.octopart.com/ERJ-6ENF1603V-Panasonic-datasheet-48891056.pdf?src-supplier=Farnell; ComponentLink9Description: http://datasheet.octopart.com/ERJ-6ENF1603V-Panasonic-datasheet-48891056.pdf?src-supplier=Farnell; ComponentLink10URL: http://datasheet.octopart.com/ERJ-6ENF1603V-Panasonic-datasheet-136608610.pdf?src-supplier=Farnell; ComponentLink10Description: http://datasheet.octopart.com/ERJ-6ENF1603V-Panasonic-datasheet-136608610.pdf?src-supplier=Farnell; ComponentLink11URL: http://datasheet.octopart.com/ERJ6ENF1603V-Panasonic---ECG-datasheet-5313456.pdf?src-supplier=Element14; ComponentLink11Description: http://datasheet.octopart.com/ERJ6ENF1603V-Panasonic---ECG-datasheet-5313456.pdf?src-supplier=Element14; ComponentLink12URL: http://datasheet.octopart.com/ERJ6ENF1603V-Panasonic---ECG-datasheet-8853621.pdf?src-supplier=Element14; ComponentLink12Description: http://datasheet.octopart.com/ERJ6ENF1603V-Panasonic---ECG-datasheet-8853621.pdf?src-supplier=Element14; ComponentLink13URL: http://datasheet.octopart.com/ERJ6ENF1603V-Panasonic---ECG-datasheet-10025800.pdf?src-supplier=Element14; ComponentLink13Description: http://datasheet.octopart.com/ERJ6ENF1603V-Panasonic---ECG-datasheet-10025800.pdf?src-supplier=Element14; ComponentLink14URL: http://datasheet.octopart.com/ERJ-6ENF1603V-Panasonic-datasheet-41391857.pdf?src-supplier=Electro+Sonic; ComponentLink14Description: http://datasheet.octopart.com/ERJ-6ENF1603V-Panasonic-datasheet-41391857.pdf?src-supplier=Electro+Sonic; ComponentLink15URL: http://datasheet.octopart.com/ERJ-6ENF1603V-Panasonic-datasheet-78375410.pdf; ComponentLink15Description: http://datasheet.octopart.com/ERJ-6ENF1603V-Panasonic-datasheet-78375410.pdf; ComponentLink16URL: http://datasheet.octopart.com/ERJ6ENF1603V-Panasonic---ECG-datasheet-15994758.pdf?src-supplier=Farnell; ComponentLink16Description: http://datasheet.octopart.com/ERJ6ENF1603V-Panasonic---ECG-datasheet-15994758.pdf?src-supplier=Farnell; Supplier Part Number 1: P160KCCT-ND
R3 R4 = ERA-6AED331V: Res Thin Film 0805 330 Ohm 0.5% 0.125W(1/8W) ±25ppm/C Molded SMD Automotive Punched T/R; Manufacturer: Panasonic; Temperature Coefficient: 25ppm/°C; Power Rating: 125mW; Voltage Rating: 200V; Supplier 1: Digi-Key; Manufacturer Part Number: ERA-6AED331V; RoHS: Yes; Category: Resistor; Stock 1: 11862; Pricing 1: 1=0.10000, 10=0.09400, 25=0.06480, 50=0.05040, 100=0.03600, 250=0.02808, 500=0.02232, 1000=0.01584 (USD); Mount: Surface Mount; Case/Package: 0805; Contact Plating: Tin; Case Code (Metric): 2012; Case Code (Imperial): 0805; Min Operating Temperature: -55°C; Max Operating Temperature: 155°C; Termination: SMD/SMT; Resistor Type: Thin Film; Resistance: 330R; Tolerance: 0.5%; Packaging: Tape and Reel; Package Quantity: 5000; Length: 2mm; Height: 0.5mm; Depth: 1.25mm; Width: 1.25mm; Military Standard: Not; Lead Free: Lead Free; ComponentLink1URL: https://datasheet.ciiva.com/24071/aoa0000ce26-197354-24071480.pdf?src-supplier=Mouser; ComponentLink1Description: https://datasheet.ciiva.com/24071/aoa0000ce26-197354-24071480.pdf?src-supplier=Mouser; ComponentLink2URL: https://datasheet.ciiva.com/9182/aoa0000ce26-9182970.pdf?src-supplier=Avnet; ComponentLink2Description: https://datasheet.ciiva.com/9182/aoa0000ce26-9182970.pdf?src-supplier=Avnet; Supplier Part Number 1: P123837CT-ND
R5 R7 = ERA-6AED472V: Res Thin Film 0805 4.7K Ohm 0.5% 0.125W(1/8W) ±25ppm/C Molded SMD Automotive Punched T/R; Manufacturer: Panasonic; Temperature Coefficient: 25ppm/°C; Power Rating: 125mW; Voltage Rating: 100V; Supplier 1: Digi-Key; Manufacturer Part Number: ERA-6AED472V; RoHS: Yes; Category: Chip SMD Resistors; Stock 1: 25343; Pricing 1: 1=0.10000, 10=0.09400, 100=0.03600, 1000=0.01584, 2500=0.01368 (USD); Case/Package: 0805; Case Code (Metric): 2012; Case Code (Imperial): 0805; Min Operating Temperature: -55°C; Max Operating Temperature: 155°C; Package Quantity: 5000; Packaging: Tape and Reel; Resistance: 4.7kR; Tolerance: 0.5%; Length: 2mm; Height: 0.5mm; Width: 1.25mm; Lead Free: Lead Free; ComponentLink1URL: https://datasheet.ciiva.com/24027/aoa0000ce26-32660-24027576.pdf?src-supplier=Mouser; ComponentLink1Description: https://datasheet.ciiva.com/24027/aoa0000ce26-32660-24027576.pdf?src-supplier=Mouser; Supplier Part Number 1: P123914CT-ND; Mount: Surface Mount; Contact Plating: Tin; Resistor Type: Metal Film,Thin Film; Depth: 1.25mm; Military Standard: Not
R6 R8 R10 R11 = ERJ-PB6D1241V: RES SMD 1.24K OHM 0.5% 1/4W 0805; Manufacturer: Panasonic; Temperature Coefficient: 50ppm/°C; Max Power Dissipation: 250mW; Supplier 1: Digi-Key; Manufacturer Part Number: ERJ-PB6D1241V; RoHS: Yes; Category: Chip SMD Resistors; Stock 1: 777; Pricing 1: 1=0.23000, 10=0.19100, 25=0.13920, 50=0.10100, 100=0.07480, 250=0.05744, 500=0.04524, 1000=0.03132 (USD); Case/Package: 0805; Case Code (Metric): 2012; Case Code (Imperial): 0805; Min Operating Temperature: -55°C; Max Operating Temperature: 155°C; Resistance: 1.24kR; Tolerance: 0.5%; Packaging: Tape and Reel; Number of Terminations: 2; Features: Automotive AEC-Q200; Length: 0.079inch; Width: 0.049inch; ComponentLink1URL: https://industrial.panasonic.com/sa/system/files/data/download/catalog/id_fixed-resistors_e_2.pdf?src-supplier=Digi-Key; ComponentLink1Description: https://industrial.panasonic.com/sa/system/files/data/download/catalog/id_fixed-resistors_e_2.pdf?src-supplier=Digi-Key; ComponentLink2URL: https://industrial.panasonic.com/cdbs/www-data/pdf/RDM0000/DMM0000COL5.pdf?src-supplier=Digi-Key; ComponentLink2Description: https://industrial.panasonic.com/cdbs/www-data/pdf/RDM0000/DMM0000COL5.pdf?src-supplier=Digi-Key; Supplier Part Number 1: P21029CT-ND; Resistor Type: Thick Film; Height - Seated (Max): 0.028inch
R9 = CSR1206FKR250: Res Thick Film 1206 250m Ohm 1% 1/2W 100ppm/C Molded SMD Paper T/R; Manufacturer: Stackpole Electronics; Max Power Dissipation: 500mW; Temperature Coefficient: 100ppm/°C; Supplier 1: Digi-Key; Manufacturer Part Number: CSR1206FKR250; RoHS: Yes; Category: Chip SMD Resistors; Stock 1: 244191; Pricing 1: 1=0.41000, 10=0.31100, 25=0.23640, 50=0.17560, 100=0.13050, 250=0.11024, 500=0.09450 (USD); Mount: Surface Mount; Case/Package: 1206; Case Code (Imperial): 1206; Contact Plating: Tin,Matte; Case Code (Metric): 3216; Min Operating Temperature: -55°C; Max Operating Temperature: 155°C; Resistance: 250mR; Tolerance: 1%; Packaging: Tape and Reel; Power Rating: 500mW; Resistor Type: Thick Film; Termination: Wraparound; Number of Terminations: 2; Length: 0.12inch; Width: 0.061inch; Height: 0.026inch; Lead Free: Lead Free; ComponentLink1URL: https://www.seielect.com/catalog/SEI-Packaging.pdf?src-supplier=Digi-Key; ComponentLink1Description: https://www.seielect.com/catalog/SEI-Packaging.pdf?src-supplier=Digi-Key; ComponentLink2URL: https://www.seielect.com/catalog/SEI-CSR_CSRN.pdf?src-supplier=Avnet+Asia; ComponentLink2Description: https://www.seielect.com/catalog/SEI-CSR_CSRN.pdf?src-supplier=Avnet+Asia; Supplier Part Number 1: CSR1206FKR250CT-ND
SW1 = 100SP1T2B4M6QE: Switch Toggle ON None ON SPDT Round Lever PC Pins 5A 250VAC 28VDC PC Mount with Bracket; Manufacturer: E-Switch; Actuator Material: Brass; Switch Function: On-On; Actuator Type: Standard Round; Voltage Rating (AC): 120V; Voltage Rating (DC): 28V; Contact Resistance: 100mR; Max Voltage Rating (AC): 250V; Illumination Type: Non-Illuminated; Electrical Life: 40000Cycles; Actuator Length: 6.46mm; Supplier 1: Digi-Key; Manufacturer Part Number: 100SP1T2B4M6QE; Category: Switch; Stock 1: 3257; Pricing 1: 1=3.01000, 10=2.69700, 25=2.54800, 50=2.43620, 100=2.31200, 250=2.21256, 500=2.03852, 1000=1.93908 (USD); Mount: Through Hole; Housing Material: Stainless Steel; Contact Material: Silver; Contact Plating: Silver; Min Operating Temperature: -30°C; Max Operating Temperature: 85°C; Throw Configuration: SPDT; Package Quantity: 1; Current Rating: 5A; Packaging: Bulk; Max Voltage Rating (DC): 28V; Termination: PC Pin; Orientation: Right Angle; Length: 12.7mm; Width: 6.86mm; Lead Free: Lead Free; ComponentLink1URL: https://datasheet.ciiva.com/2904/t111069-2904823.pdf?src-supplier=Digi-Key; ComponentLink1Description: https://datasheet.ciiva.com/2904/t111069-2904823.pdf?src-supplier=Digi-Key; ComponentLink2URL: https://datasheet.ciiva.com/16154/100-16154566.pdf?src-supplier=Onlinecomponents.com; ComponentLink2Description: https://datasheet.ciiva.com/16154/100-16154566.pdf?src-supplier=Onlinecomponents.com; ComponentLink3URL: http://datasheet.octopart.com/100SP1T2B4M6QE-E-Switch-datasheet-501321.pdf?src-supplier=Electro+Sonic; ComponentLink3Description: http://datasheet.octopart.com/100SP1T2B4M6QE-E-Switch-datasheet-501321.pdf?src-supplier=Electro+Sonic; ComponentLink4URL: http://datasheet.octopart.com/100SP1T2B4M6QE-E-Switch-datasheet-41351065.pdf?src-supplier=Farnell; ComponentLink4Description: http://datasheet.octopart.com/100SP1T2B4M6QE-E-Switch-datasheet-41351065.pdf?src-supplier=Farnell; ComponentLink5URL: http://datasheet.octopart.com/100SP1T2B4M6QE-E-Switch-datasheet-112052116.pdf?src-supplier=Electro+Sonic; ComponentLink5Description: http://datasheet.octopart.com/100SP1T2B4M6QE-E-Switch-datasheet-112052116.pdf?src-supplier=Electro+Sonic; ComponentLink6URL: http://datasheet.octopart.com/100SP1T2B4M6QE-E-Switch-datasheet-26830754.pdf?src-supplier=Electro+Sonic; ComponentLink6Description: http://datasheet.octopart.com/100SP1T2B4M6QE-E-Switch-datasheet-26830754.pdf?src-supplier=Electro+Sonic; ComponentLink7URL: http://datasheet.octopart.com/100SP1T2B4M6QE-E-Switch-datasheet-62101310.pdf?src-supplier=Electro+Sonic; ComponentLink7Description: http://datasheet.octopart.com/100SP1T2B4M6QE-E-Switch-datasheet-62101310.pdf?src-supplier=Electro+Sonic; Supplier Part Number 1: EG2362-ND
U1 U2 = LDL1117S50R: LDL1117 Series 1.2 A 5 V High PSRR LDO Linear Voltage Regulator - SOT-223; Manufacturer: STMicroelectronics; Output Type: Fixed; Output Configuration: Positive; Number of Regulators: 1; Max Input Voltage: 18V; Min Output Voltage: 5V; Dropout Voltage: 600mV; Output Current: 1.2A; Quiescent Current: 500uA; Power Supply Rejection Ratio (PSRR): 65dB; Supplier 1: Digi-Key; Manufacturer Part Number: LDL1117S50R; Category: IC; Stock 1: 653; Pricing 1: 1=0.48000, 10=0.36000, 25=0.32440, 100=0.17700, 250=0.17112, 500=0.15340, 1000=0.11800 (USD); Mount: Surface Mount; Case/Package: TO-261-4; Min Operating Temperature: -40°C; Max Operating Temperature: 125°C; Packaging: Tape and Reel; ComponentLink1URL: http://www.farnell.com/datasheets/2259188.pdf?src-supplier=Farnell; ComponentLink1Description: http://www.farnell.com/datasheets/2259188.pdf?src-supplier=Farnell; ComponentLink2URL: http://www.st.com/content/ccc/resource/technical/document/datasheet/group3/0e/5a/00/ca/10/1a/4f/a5/DM00366442/files/DM00366442.pdf/jcr:content/translations/en.DM00366442.pdf?src-supplier=Digi-Key; ComponentLink2Description: http://www.st.com/content/ccc/resource/technical/document/datasheet/group3/0e/5a/00/ca/10/1a/4f/a5/DM00366442/files/DM00366442.pdf/jcr:content/translations/en.DM00366442.pdf?src-supplier=Digi-Key; ComponentLink3URL: http://www.farnell.com/datasheets/2259188.pdf?src-supplier=Newark; ComponentLink3Description: http://www.farnell.com/datasheets/2259188.pdf?src-supplier=Newark; ComponentLink4URL: http://datasheet.octopart.com/LDL1117S50R-STMicroelectronics-datasheet-82510909.pdf?src-supplier=Farnell; ComponentLink4Description: http://datasheet.octopart.com/LDL1117S50R-STMicroelectronics-datasheet-82510909.pdf?src-supplier=Farnell; ComponentLink5URL: http://datasheet.octopart.com/LDL1117S50R-STMicroelectronics-datasheet-93404513.pdf?src-supplier=Ciiva+Crawler; ComponentLink5Description: http://datasheet.octopart.com/LDL1117S50R-STMicroelectronics-datasheet-93404513.pdf?src-supplier=Ciiva+Crawler; Supplier Part Number 1: 497-17240-1-ND